# Altium schematic sheet TM1637_Display.SchDoc
size A4; SheetNumber: 6; SheetTotal: 7
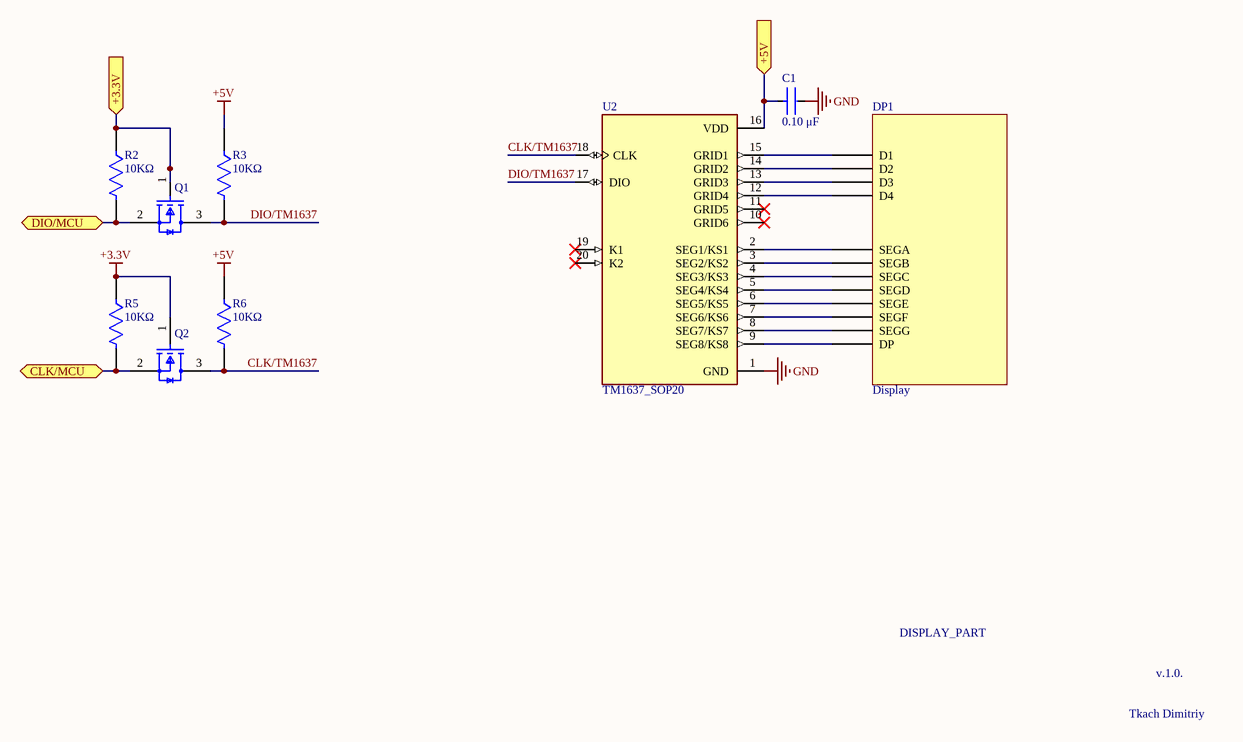
[diagram p0: TM1637_Display.SchDoc]

## Parts
C1  Capacitance: 0.10 μF  [CAPC3216X18M]  (hidden comment: C1206C104K5RACAUTO)
DP1  Display  [3461BS-1]
Q1  2N7002-7-F  [FP-SOT23-MFG]  (value not drawn)
Q2  2N7002-7-F  [FP-SOT23-MFG]  (value not drawn)
R2  Resistance: 10KΩ  [RESC3216X06M]  (hidden comment: CRGP1206F10K)
R3  Resistance: 10KΩ  [RESC3216X06M]  (hidden comment: CRGP1206F10K)
R5  Resistance: 10KΩ  [RESC3216X06M]  (hidden comment: CRGP1206F10K)
R6  Resistance: 10KΩ  [RESC3216X06M]  (hidden comment: CRGP1206F10K)
U2  TM1637_SOP20  [SOIC127P1035X255-20N]

## Ports
+3.3V (in, see MainSheet[4B], NTC[3B], Power[3B], STM8S103F3P6[3B], UART[2B]), +5V (in, see MainSheet[4B], Power[3B], Relay[2B], UART[3B]), CLK/MCU (bidir, see MainSheet[3B], STM8S103F3P6[2B]), DIO/MCU (bidir, see MainSheet[3B], STM8S103F3P6[2B])

## Nets
+3.3V: Q2.1(G) R5.1
+5V: R3.1 R6.1
GND: C1.2 U2.1(GND)
+3.3V: Q1.1(G) R2.1 ; port +3.3V  [a separate net that carries the same name]
+5V: C1.1 U2.16(VDD) ; port +5V  [a separate net that carries the same name]
CLK/MCU: Q2.2(S) R5.2 ; port CLK/MCU
CLK/TM1637: Q2.3(D) R6.2 U2.18(CLK)
DIO/MCU: Q1.2(S) R2.2 ; port DIO/MCU
DIO/TM1637: Q1.3(D) R3.2 U2.17(DIO)
NetDP1_D1: DP1.D1 U2.15(GRID1)
NetDP1_D2: DP1.D2 U2.14(GRID2)
NetDP1_D3: DP1.D3 U2.13(GRID3)
NetDP1_D4: DP1.D4 U2.12(GRID4)
NetDP1_DP: DP1.DP U2.9(SEG8/KS8)
NetDP1_SEGA: DP1.SEGA U2.2(SEG1/KS1)
NetDP1_SEGB: DP1.SEGB U2.3(SEG2/KS2)
NetDP1_SEGC: DP1.SEGC U2.4(SEG3/KS3)
NetDP1_SEGD: DP1.SEGD U2.5(SEG4/KS4)
NetDP1_SEGE: DP1.SEGE U2.6(SEG5/KS5)
NetDP1_SEGF: DP1.SEGF U2.7(SEG6/KS6)
NetDP1_SEGG: DP1.SEGG U2.8(SEG7/KS7)

Not connected (* = marked no-connect by the designer): U2 10(GRID6)* 11(GRID5)* 19(K1)* 20(K2)*

## Notes on the sheet
- DISPLAY_PART
- v.1.0.
- Tkach Dimitriy

## Library data of the parts
C1 = CMP-03020-005759-1: CAP CER 0.1UF 50V X7R 1206; Manufacturer: KEMET; Temperature Coefficient: 15%; Value: 0.10 μF; Material: Ceramic; Automotive Grade: Grade 0; Tolerance: 0.1; RoHS: TRUE; Lead Free: Yes; ComponentLink2Description: Datasheet; Automotive: Yes; Temperature Characteristic: X7R; Temperature Range Low: -55°C; Voltage Rating: 50 V; Device Class L1: Passive Components; Ipc Land Pattern Name: CAPC320160X78; Mouser Description: Multilayer Ceramic Capacitors MLCC - SMD/SMT 0.1uF 50volts 10% X7R AUTO; Octopart: https://octopart.com/c1206c104k5racauto-kemet-12595586; Device Class L3: Ceramic Capacitors; Manufacturer Part Number: C1206C104K5RACAUTO; Digikey Description: CAP CER 0.1UF 50V X7R 1206; Temperature Range High: +150°C; Temperature: -55°C to +150°C; Device Class L2: Capacitors; ComponentLink2URL: https://content.kemet.com/datasheets/KEM_C1007_X8R_ULTRA_150C_SMD.pdf; Package: C1206C-EB; Category: Cap; Height: 0.88mm
DP1 = Component_1_1
Q1 Q2 = 3b9c635fedb024a5347a57b145af9cc: MOSFET N-CH 60V 115MA SOT23-3; Turn-On Delay Time: 7ns; Turn-Off Delay Time: 11ns; Drain to Source Resistance: 7.5R; Rise Time: 3ns; Drain to Source Breakdown Voltage: 70V; Input Capacitance: 50pF; Number of Elements: 1; Power Dissipation: 540mW; Max Power Dissipation: 300mW; Fall Time: 5.6ns; Gate to Source Voltage (Vgs): 20V; Threshold Voltage: 2.5V; Element Configuration: Single; Termination: SMD/SMT; Weight: 0.000282oz; Radiation Hardening: No; Max Operating Temperature: 150°C; On-State Resistance: 7.5R; Mount: Surface Mount; Current Rating: 115mA; Contact Plating: Tin; Lead Free: Lead Free; Min Operating Temperature: -55°C; Number of Pins: 3; REACH SVHC: No SVHC; Drain to Source Voltage (Vdss): 60V; Width: 1.3mm; Package Quantity: 3000; Length: 2.9mm; Case/Package: SOT-23; Number of Channels: 1; Dual Supply Voltage: 60V; Packaging: Tape and Reel; Height: 1mm; Voltage Rating (DC): 60V; Nominal Vgs: 2.5V; Continuous Drain Current (ID): 115mA; Voltage: 60V; Rds On Max: 7.5R
R2 R3 R5 R6 = CMP-03211-004788-1: CRGP 1206 10K 1%; Manufacturer: TE; Temperature Coefficient: ±100ppm/°C; Value: 10KΩ; Tolerance: 0.01; Power Rating: 0.5W; Voltage Rating: 200V; Package: CRGP1206; Ambient Temperature Range High: +70°C; Device Class L2: Resistors; Lead Free: Yes; Automotive: No; Series: CRGP; Temperature Range High: +155°C; Ipc Land Pattern Name: RESC310155X55; Device Class L1: Passive Components; Octopart: https://octopart.com/crgp1206f10k-te+connectivity-91018843; Temperature: -55°C to +155°C; Category: Res; Height: 0.65mm; Temperature Range Low: -55°C; RoHS: TRUE; Manufacturer Part Number: CRGP1206F10K; Digikey Description: CRGP 1206 10K 1%; Device Class L3: Chip SMD Resistors; Composition: Thick Film; ComponentLink2URL: https://www.mouser.com/datasheet/2/418/NG_DS_9-1773463-9_A-1358566.pdf; ComponentLink2Description: Datasheet
U2 = TM1637_SOP20: LED Drive Control Special Circuit; MF: Titan Micro Electronics; SnapEDA_Link: https://www.snapeda.com/parts/TM1637_SOP20/Titan+Micro+Electronics/view-part/?ref=snap; Package: Package; Value: *; MP: TM1637_SOP20; Check_prices: https://www.snapeda.com/parts/TM1637_SOP20/Titan+Micro+Electronics/view-part/?ref=eda